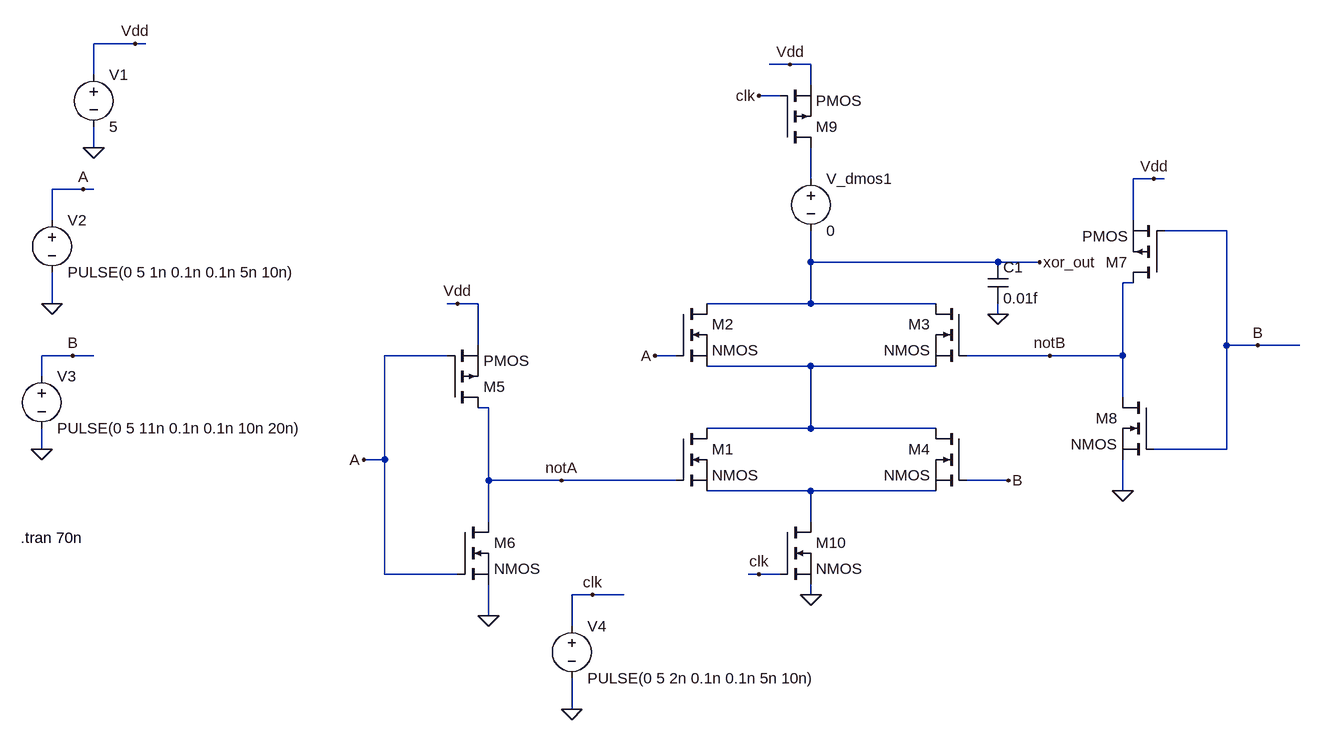
[diagram p0: schematic xor3.asc]
xor3.asc, the LTspice schematic file:
Version 4
SHEET 1 1332 788
WIRE -464 -256 -528 -256
WIRE -448 -256 -464 -256
WIRE 544 -224 512 -224
WIRE 576 -224 544 -224
WIRE -528 -208 -528 -256
WIRE 576 -192 576 -224
WIRE 528 -176 496 -176
WIRE -528 -96 -528 -128
WIRE 576 -48 576 -96
WIRE 1104 -48 1072 -48
WIRE 1120 -48 1104 -48
WIRE -544 -32 -592 -32
WIRE -528 -32 -544 -32
WIRE -592 16 -592 -32
WIRE 1072 16 1072 -48
WIRE 1216 32 1120 32
WIRE 576 80 576 32
WIRE 864 80 576 80
WIRE 928 80 864 80
WIRE 1072 112 1056 112
WIRE -592 144 -592 96
WIRE 32 144 16 144
WIRE 64 144 32 144
WIRE 576 144 576 80
WIRE 576 144 416 144
WIRE 768 144 576 144
WIRE 864 160 864 144
WIRE 64 208 64 144
WIRE 1216 208 1216 32
WIRE 1264 208 1216 208
WIRE 1328 208 1264 208
WIRE -560 224 -608 224
WIRE -528 224 -560 224
WIRE 16 224 -80 224
WIRE 368 224 336 224
WIRE 944 224 816 224
WIRE 1056 224 1056 112
WIRE 1056 224 944 224
WIRE 576 240 416 240
WIRE 768 240 576 240
WIRE -608 256 -608 224
WIRE 1056 288 1056 224
WIRE 80 304 64 304
WIRE 576 336 576 240
WIRE 576 336 416 336
WIRE 768 336 576 336
WIRE -608 368 -608 336
WIRE 1216 368 1216 208
WIRE 1216 368 1104 368
WIRE -80 384 -80 224
WIRE -80 384 -112 384
WIRE 80 416 80 304
WIRE 192 416 80 416
WIRE 368 416 192 416
WIRE 880 416 816 416
WIRE 576 432 416 432
WIRE 768 432 576 432
WIRE 1056 432 1056 384
WIRE 80 480 80 416
WIRE 576 480 576 432
WIRE -80 560 -80 384
WIRE 32 560 -80 560
WIRE 496 560 480 560
WIRE 528 560 496 560
WIRE 240 592 208 592
WIRE 288 592 240 592
WIRE 576 592 576 576
WIRE 80 624 80 576
WIRE 208 640 208 592
WIRE 208 768 208 720
FLAG 80 624 0
FLAG 32 144 Vdd
FLAG 1056 432 0
FLAG 1104 -48 Vdd
FLAG -528 -96 0
FLAG -464 -256 Vdd
FLAG -592 144 0
FLAG -608 368 0
FLAG -544 -32 A
FLAG -560 224 B
FLAG 336 224 A
FLAG -112 384 A
FLAG 192 416 notA
FLAG 880 416 B
FLAG 1264 208 B
FLAG 944 224 notB
FLAG 544 -224 Vdd
FLAG 576 592 0
FLAG 208 768 0
FLAG 240 592 clk
FLAG 496 560 clk
FLAG 496 -176 clk
FLAG 928 80 xor_out
FLAG 864 160 0
SYMBOL nmos 368 336 R0
SYMATTR InstName M1
SYMBOL nmos 368 144 R0
SYMATTR InstName M2
SYMBOL nmos 816 144 M0
SYMATTR InstName M3
SYMBOL nmos 816 336 M0
SYMATTR InstName M4
SYMBOL pmos 16 304 M180
SYMATTR InstName M5
SYMBOL nmos 32 480 R0
SYMATTR InstName M6
SYMBOL pmos 1120 112 R180
SYMATTR InstName M7
SYMBOL nmos 1104 288 M0
SYMATTR InstName M8
SYMBOL voltage -528 -224 R0
WINDOW 123 0 0 Left 2
WINDOW 39 0 0 Left 2
SYMATTR InstName V1
SYMATTR Value 5
SYMBOL voltage -592 0 R0
WINDOW 123 0 0 Left 2
WINDOW 39 0 0 Left 2
SYMATTR InstName V2
SYMATTR Value PULSE(0 5 1n 0.1n 0.1n 5n 10n)
SYMBOL voltage -608 240 R0
WINDOW 123 0 0 Left 2
WINDOW 39 0 0 Left 2
SYMATTR InstName V3
SYMATTR Value PULSE(0 5 11n 0.1n 0.1n 10n 20n)
SYMBOL voltage 576 -64 R0
WINDOW 123 0 0 Left 2
WINDOW 39 0 0 Left 2
SYMATTR InstName V_dmos1
SYMATTR Value 0
SYMBOL pmos 528 -96 M180
SYMATTR InstName M9
SYMBOL nmos 528 480 R0
SYMATTR InstName M10
SYMBOL voltage 208 624 R0
WINDOW 123 0 0 Left 2
WINDOW 39 0 0 Left 2
SYMATTR InstName V4
SYMATTR Value PULSE(0 5 2n 0.1n 0.1n 5n 10n)
SYMBOL cap 848 80 R0
SYMATTR InstName C1
SYMATTR Value 0.01f
TEXT -640 504 Left 2 !.tran 70n

The netlist it stands for:
* xor3.asc
M1 N002 notA N003 N003 NMOS
M2 xor_out A N002 N002 NMOS
M3 xor_out notB N002 N002 NMOS
M4 N002 B N003 N003 NMOS
M5 notA A Vdd Vdd PMOS
M6 notA A 0 0 NMOS
M7 notB B Vdd Vdd PMOS
M8 notB B 0 0 NMOS
V1 Vdd 0 5
V2 A 0 PULSE(0 5 1n 0.1n 0.1n 5n 10n)
V3 B 0 PULSE(0 5 11n 0.1n 0.1n 10n 20n)
V_dmos1 N001 xor_out 0
M9 N001 clk Vdd Vdd PMOS
M10 N003 clk 0 0 NMOS
V4 clk 0 PULSE(0 5 2n 0.1n 0.1n 5n 10n)
C1 xor_out 0 0.01f
.model NMOS NMOS
.model PMOS PMOS
.lib standard.mos
.tran 70n
.backanno
.end